# EAGLE design board (EAGLE 9.3.0)
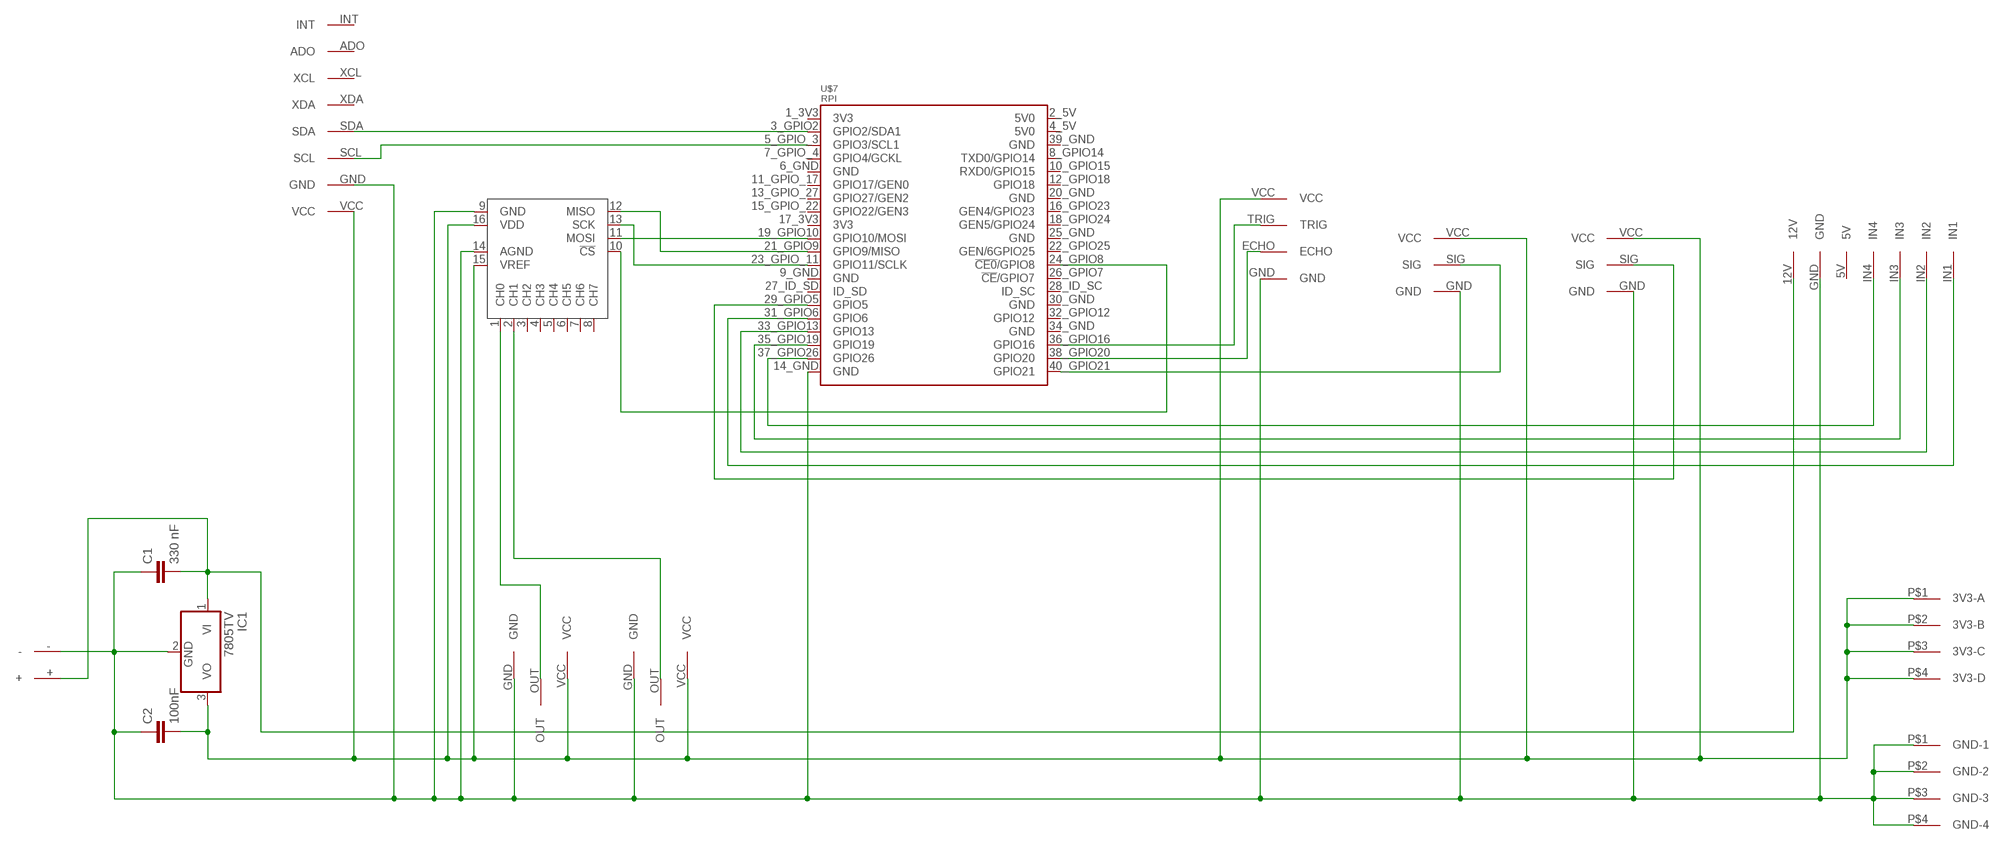
[diagram p0: schematic, sheet 1]

## Parts
C1  330 nF  C2.5/2  [C2.5-2]
C2  100nF  C2.5/2  [C2.5-2]
IC1  7805TV  [TO220V]
U$1  12V_SRC  [12V_SRC]
U$2  DC_REL  [DC_REL]
U$3  DC_REL  [DC_REL]
U$4  MCP3008P  [DIL16]
U$5  L298N-CONN  [L298N-CONN]
U$6  MPU6050  [MPU6050]
U$7  RPI  [RPI]
U$8  HC-SR04  [HC-SR04]
U$9  DISTANCE_SENSOR_ANALOG  [DISTANCE_SENSOR_ANALOG]
U$10  DISTANCE_SENSOR_ANALOG  [DISTANCE_SENSOR_ANALOG]
U$11  3V3-4  [3.3V-4]
U$12  GND-4  [GND-4]

## Nets
GND@3 [Power]: C1.1 C2.1 IC1.2(GND) U$1.- U$2.GND U$3.GND U$4.9(GND) U$4.14(AGND) U$5.GND U$6.GND U$7.14_GND(GND) U$8.GND U$9.GND U$10.GND U$12.P$1(GND-1) U$12.P$2(GND-2) U$12.P$3(GND-3) U$12.P$4(GND-4)
N$1: U$4.1(CH0) U$9.OUT
N$2: U$4.2(CH1) U$10.OUT
N$7 [Power]: C1.2 IC1.1(VI) U$1.+ U$5.12V
N$9: U$6.SDA U$7.3_GPIO2(GPIO2/SDA1)
N$11: U$6.SCL U$7.5_GPIO_3(GPIO3/SCL1)
N$14: U$5.IN4 U$7.37_GPIO26(GPIO26)
N$15: U$4.11(MOSI) U$7.19_GPIO10(GPIO10/MOSI)
N$16: U$4.12(MISO) U$7.21_GPIO9(GPIO9/MISO)
N$17: U$4.13(SCK) U$7.23_GPIO_11(GPIO11/SCLK)
N$18: U$4.10(!CS) U$7.24_GPIO8(!CE0!/GPIO8)
N$19: U$5.IN3 U$7.35_GPIO19(GPIO19)
N$21: U$5.IN2 U$7.33_GPIO13(GPIO13)
N$22: U$5.IN1 U$7.31_GPIO6(GPIO6)
N$23: U$3.SIG U$7.29_GPIO5(GPIO5)
N$24: U$2.SIG U$7.40_GPIO21(GPIO21)
N$25: U$7.38_GPIO20(GPIO20) U$8.ECHO
N$26: U$7.36_GPIO16(GPIO16) U$8.TRIG
N$31 [Power]: C2.2 IC1.3(VO) U$2.VCC U$3.VCC U$4.15(VREF) U$4.16(VDD) U$6.VCC U$8.VCC U$9.VCC U$10.VCC U$11.P$1(3V3-A) U$11.P$2(3V3-B) U$11.P$3(3V3-C) U$11.P$4(3V3-D)
Unconnected: U$4.3(CH2) U$4.4(CH3) U$4.5(CH4) U$4.6(CH5) U$4.7(CH6) U$4.8(CH7) U$5.5V U$6.ADO U$6.INT U$6.XCL U$6.XDA U$7.1_3V3(3V3) U$7.2_5V(5V0) U$7.4_5V(5V0) U$7.6_GND(GND) U$7.7_GPIO_4(GPIO4/GCKL) U$7.8_GPIO14(TXD0/GPIO14) U$7.9_GND(GND) U$7.10_GPIO15(RXD0/GPIO15) U$7.11_GPIO_17(GPIO17/GEN0) U$7.12_GPIO18(GPIO18) U$7.13_GPIO_27(GPIO27/GEN2) U$7.15_GPIO_22(GPIO22/GEN3) U$7.16_GPIO23(GEN4/GPIO23) U$7.17_3V3(3V3) U$7.18_GPIO24(GEN5/GPIO24) U$7.20_GND(GND) U$7.22_GPIO25(GEN/6GPIO25) U$7.25_GND(GND) U$7.26_GPIO7(!CE!/GPIO7) U$7.27_ID_SD(ID_SD) U$7.28_ID_SC(ID_SC) U$7.30_GND(GND) U$7.32_GPIO12(GPIO12) U$7.34_GND(GND) U$7.39_GND(GND)

## Library data of the parts
C1 C2 = capacitor-wima:C: CAPACITOR naming: grid - package width
IC1 = linear:78*: Positive VOLTAGE REGULATOR Source: http://cache.national.com/ds/LM/LM78L05.pdf http://www.fairchildsemi.com/ds/LM/LM7805.pdf
U$1 = home-mind:12V_SRC
U$2 U$3 = home-mind:DC_REL
U$4 = MCP3008:MCP3008
U$5 = home-mind:L298N-CONN
U$6 = home-mind:MPU6050
U$7 = home-mind:RPI
U$8 = home-mind:HC-SR04
U$9 U$10 = home-mind:DISTANCE_SENSOR_ANALOG
U$11 = home-mind:3V3-4
U$12 = home-mind:GND-4

## Net classes
0 default: width 0.3 mm, drill 0.3 mm, clearance 0.3 mm
1 Power: width 1.2 mm, drill 0.5 mm, clearance 0.5 mm

## Board
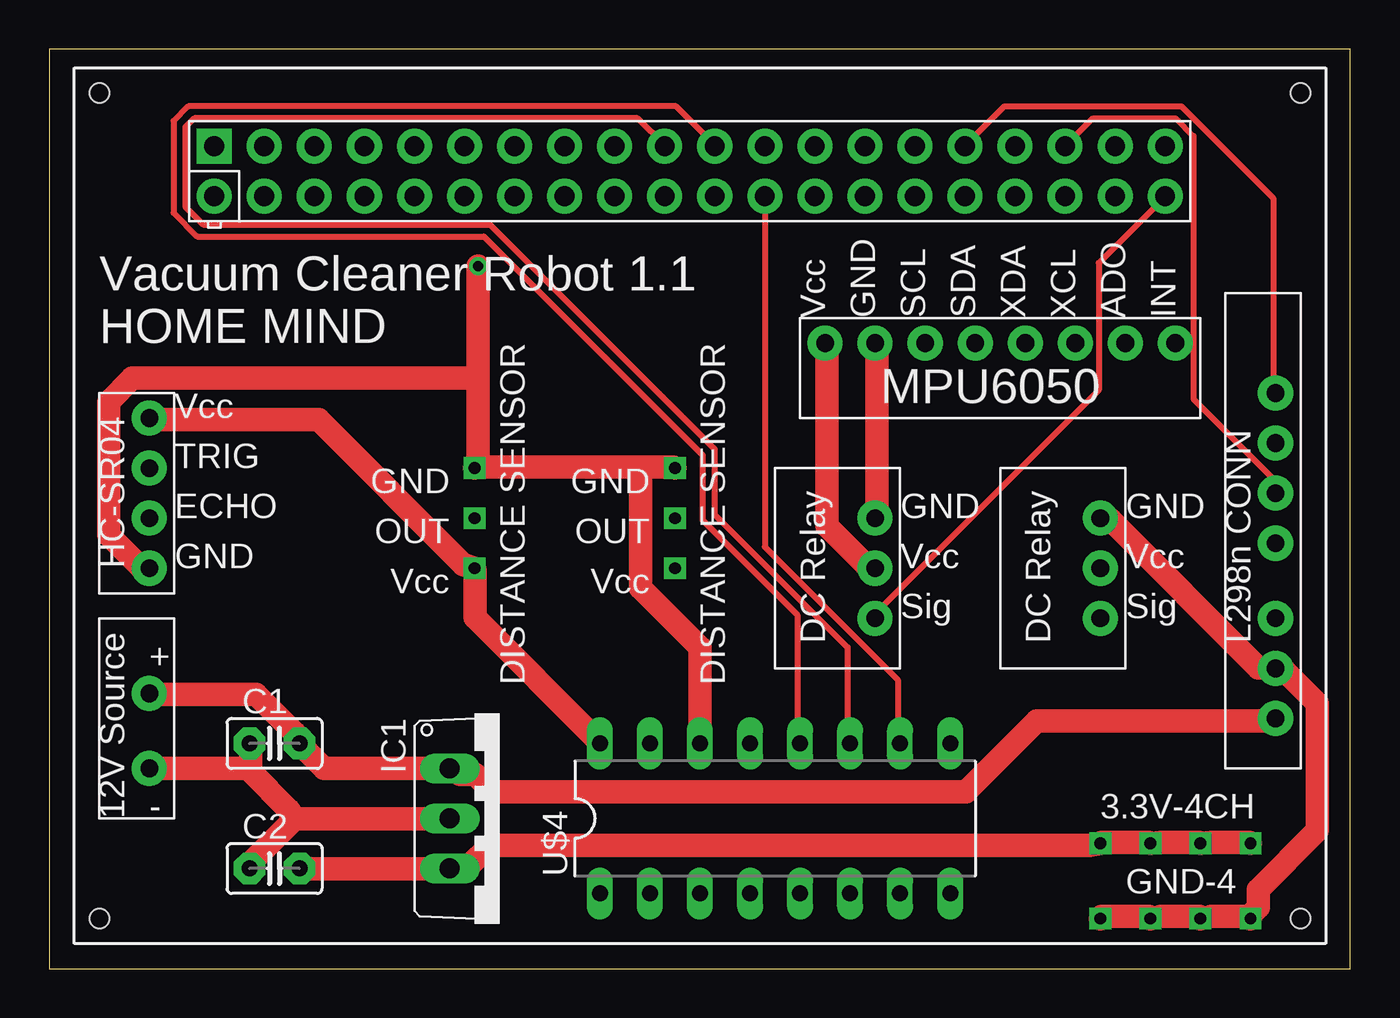
[diagram p1: board, top side]
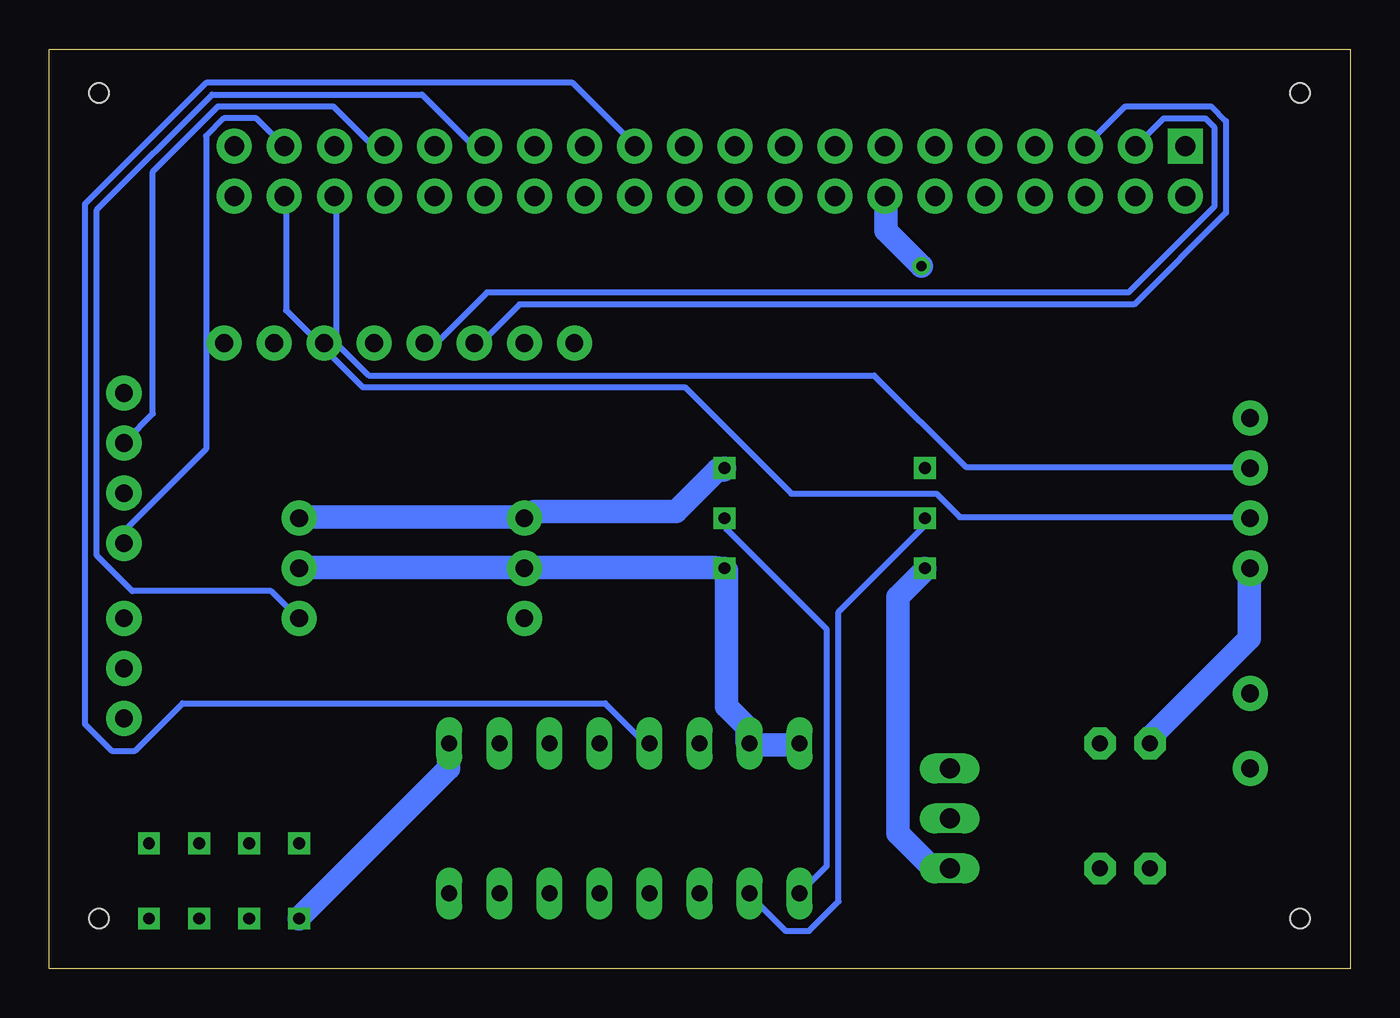
[diagram p2: board, bottom side, seen from below]

Size 66.02 x 46.66 mm. Coordinates in mm from the lower left corner, seen from the top.
Outline: 0,0 66.02,0 66.02,46.66 0,46.66 0,0
Copper layers (1*16): Top 0.035mm / dielectric 1.5mm / Bottom 0.035mm
Design rules "default": minimum track width 6mil, minimum drill 0.35mm, track to track 6mil, track to pad 6mil, pad to pad 6mil, via to via 6mil, smd to smd 6mil, copper to edge 40mil, drill to drill 6mil, minimum pad ring 10mil, minimum via ring 8mil, stop-mask expansion 4mil, vias tented up to drill 0mil, thermal gap 10mil
Holes 1 mm at 63.5,2.54 2.54,44.45 2.54,2.54 63.5,44.45

### Footprints (pad centres in the part's own frame; a part is rotated, then mirrored left to right if it is on the bottom)
C2.5-2 = drill 0.813 pad 1.6 octagon: 1 -1.27,0; 2 1.27,0
TO220V = drill 1.016 long: 1 -2.54,-2.54; 2 0,-2.54; 3 2.54,-2.54
12V_SRC = drill 0.9 pad 1.778: + 0,3.81; - 0,0
DC_REL = drill 0.9 pad 1.778: GND 0,5.08; SIG 0,0; VCC 0,2.54
DIL16 = drill 0.813 long: 1 -8.89,-3.81; 2 -6.35,-3.81; 3 -3.81,-3.81; 4 -1.27,-3.81; 5 1.27,-3.81; 6 3.81,-3.81; 7 6.35,-3.81; 8 8.89,-3.81; 9 8.89,3.81; 10 6.35,3.81; 11 3.81,3.81; 12 1.27,3.81; 13 -1.27,3.81; 14 -3.81,3.81; 15 -6.35,3.81; 16 -8.89,3.81
L298N-CONN = drill 0.9 pad 1.778: 5V 0,-11.43; 12V 0,-16.51; GND 0,-13.97; IN1 0,0; IN2 0,-2.54; IN3 0,-5.08; IN4 0,-7.62
MPU6050 = drill 0.9 pad 1.778: ADO 0,-5.08; GND 0,7.62; INT 0,-7.62; SCL 0,5.08; SDA 0,2.54; VCC 0,10.16; XCL 0,-2.54; XDA 0,0
RPI = drill 1 pad 1.778 square: 1_3V3 -24.65,1.1 | drill 1 pad 1.778: 2_5V -24.65,-1.44; 3_GPIO2 -22.11,1.1; 4_5V -22.11,-1.44; 5_GPIO_3 -19.57,1.1; 6_GND -19.57,-1.44; 7_GPIO_4 -17.03,1.1; 8_GPIO14 -17.03,-1.44; 9_GND -14.49,1.1; 10_GPIO15 -14.49,-1.44; 11_GPIO_17 -11.95,1.1; 12_GPIO18 -11.95,-1.44; 13_GPIO_27 -9.41,1.1; 14_GND -9.41,-1.44; 15_GPIO_22 -6.87,1.1; 16_GPIO23 -6.87,-1.44; 17_3V3 -4.33,1.1; 18_GPIO24 -4.33,-1.44; 19_GPIO10 -1.79,1.1; 20_GND -1.79,-1.44; 21_GPIO9 0.75,1.1; 22_GPIO25 0.75,-1.44; 23_GPIO_11 3.29,1.1; 24_GPIO8 3.29,-1.44; 25_GND 5.83,1.1; 26_GPIO7 5.83,-1.44; 27_ID_SD 8.37,1.1; 28_ID_SC 8.37,-1.44; 29_GPIO5 10.91,1.1; 30_GND 10.91,-1.44; 31_GPIO6 13.45,1.1; 32_GPIO12 13.45,-1.44; 33_GPIO13 15.99,1.1; 34_GND 15.99,-1.44; 35_GPIO19 18.53,1.1; 36_GPIO16 18.53,-1.44; 37_GPIO26 21.07,1.1; 38_GPIO20 21.07,-1.44; 39_GND 23.61,1.1; 40_GPIO21 23.61,-1.44
HC-SR04 = drill 0.9 pad 1.778: ECHO 0,0; GND 0,-2.54; TRIG 0,2.54; VCC 0,5.08
DISTANCE_SENSOR_ANALOG = drill 0.6 square: GND 0,-2.54; OUT 0,0; VCC 0,2.54
3.3V-4 = drill 0.6 square: P$1 0,0; P$2 2.54,0; P$3 5.08,0; P$4 7.62,0
GND-4 = drill 0.6 square: P$1 0,0; P$2 2.54,0; P$3 5.08,0; P$4 7.62,0

### Placement (x,y rotation side)
C1  11.43,11.43 0 top
C2  11.43,5.08 0 top
IC1  22.86,7.62 270 top
U$1  5.08,10.16 0 top
U$2  41.91,17.78 0 top
U$3  53.34,17.78 0 top
U$4  36.83,7.62 0 top
U$5  62.23,29.21 0 top
U$6  49.53,31.75 90 top
U$7  33.02,40.64 0 top
U$8  5.08,22.86 0 top
U$9  31.75,22.86 180 top
U$10  21.59,22.86 180 top
U$11  53.34,6.35 0 top
U$12  53.34,2.54 0 top

### Tracks (layer width: path | path; a pad name or v marks a point on that pad's centre or on a via)
GND@3  (via drill 0.5)
  Top 1.2: U$12.P$1 53.41,2.66 55.81,2.66 U$12.P$2 56.41,2.66 58.36,2.66 U$12.P$3 58.96,2.66 60.91,2.66 | 60.91,2.66 U$12.P$4 | U$2.GND 42.01,22.91 42.01,31.61 U$6.GND | U$3.GND 53.41,22.76 53.86,22.76 61.36,15.26 62.11,15.26 U$5.GND 62.71,15.11 64.36,13.46 64.36,7.01 61.36,4.01 61.36,3.11 60.91,2.66 | 12.46,7.61 20.26,7.61 IC1.2 | 12.46,7.61 10.06,5.21 C2.1 | 10.21,10.16 10.21,10.01 12.16,8.06 12.46,7.61 | 10.21,10.16 10.21,11.36 C1.1 | 10.21,10.16 U$1.- | 30.01,25.46 31.66,25.46 U$9.GND | 30.01,25.46 21.61,25.46 U$10.GND 21.76,25.91 21.76,29.96 | 30.01,25.46 30.01,19.31 33.01,16.31 33.01,11.51 U$4.14 | 21.76,29.96 v21.76,35.66 | 21.76,29.96 4.21,29.96 3.01,28.76 3.01,22.01 4.66,20.36 4.96,20.36 U$8.GND
  Bottom 1.2: U$4.9 45.76,11.36 45.76,10.16 53.26,2.66 U$12.P$1 | U$3.GND 53.26,22.91 42.01,22.91 U$2.GND 41.41,23.21 34.21,23.21 32.11,25.31 31.81,25.31 U$9.GND | U$8.GND 5.11,20.21 5.11,16.76 10.06,11.81 10.06,11.51 C1.1 | v21.76,35.66 23.56,37.46 23.56,39.11 U$7.14_GND
N$1
  Bottom 0.3: U$9.OUT 31.66,22.76 31.66,22.31 26.56,17.21 26.56,5.21 27.91,3.86 U$4.1
N$2
  Bottom 0.3: U$10.OUT 21.61,22.76 21.61,22.46 25.96,18.11 25.96,3.41 27.46,1.91 28.66,1.91 30.46,3.71 U$4.2
N$7
  Top 1.2: U$1.+ 5.11,13.91 10.51,13.91 12.46,11.96 C1.2 12.76,11.36 13.96,10.16 IC1.1 20.86,9.86 21.61,9.86 22.51,8.96 46.51,8.96 50.11,12.56 62.11,12.56 U$5.12V
N$9
  Bottom 0.3: U$6.SDA 46.96,31.76 46.36,31.76 43.81,34.31 11.26,34.31 6.91,38.66 6.91,42.71 7.36,43.16 9.46,43.16 10.81,41.81 U$7.3_GPIO2
N$11
  Bottom 0.3: U$6.SCL 44.41,31.76 44.11,31.76 42.16,33.71 10.96,33.71 6.31,38.36 6.31,43.01 7.06,43.76 11.41,43.76 13.36,41.81 U$7.5_GPIO_3
N$14
  Bottom 0.3: U$7.37_GPIO26 55.51,43.16 57.16,43.16 58.06,42.26 58.06,26.36 62.11,22.31 62.11,21.71 U$5.IN4
N$15
  Top 0.3: U$4.11 40.51,11.51 40.51,16.31 33.76,23.06 33.76,26.36 22.36,37.76 7.81,37.76 6.91,38.66 6.91,42.71 7.36,43.16 29.86,43.16 31.21,41.81 U$7.19_GPIO10
N$16
  Top 0.3: U$4.12 37.96,11.51 37.96,17.96 33.16,22.76 33.16,26.06 22.06,37.16 7.51,37.16 6.31,38.36 6.31,43.01 7.06,43.76 31.81,43.76 33.76,41.81 U$7.21_GPIO9
N$17
  Bottom 0.3: U$4.13 35.56,11.51 35.86,11.51 37.81,13.46 59.26,13.46 61.66,11.06 62.86,11.06 64.21,12.41 64.21,38.81 58.06,44.96 39.46,44.96 36.31,41.81 U$7.23_GPIO_11
N$18
  Top 0.3: U$7.24_GPIO8 36.31,21.41 43.06,14.66 43.06,11.51 U$4.10
N$19
  Top 0.3: U$5.IN3 62.11,24.26 62.11,24.86 58.06,28.91 58.06,42.26 57.16,43.16 52.96,43.16 51.61,41.81 U$7.35_GPIO19
N$21
  Bottom 0.3: U$7.33_GPIO13 49.06,41.81 49.66,41.81 51.61,43.76 57.46,43.76 60.76,40.46 60.76,28.16 62.11,26.81 U$5.IN2
N$22
  Top 0.3: U$5.IN1 62.11,29.21 62.11,39.11 57.46,43.76 48.46,43.76 46.51,41.81 U$7.31_GPIO6
N$23
  Bottom 0.3: U$7.29_GPIO5 43.96,41.81 44.56,41.81 47.11,44.36 57.76,44.36 63.61,38.51 63.61,20.96 61.81,19.16 54.76,19.16 53.41,17.81 U$3.SIG
N$24
  Top 0.3: U$2.SIG 42.01,17.81 42.01,18.11 53.26,29.36 53.26,35.81 56.56,39.11 U$7.40_GPIO21
N$25
  Bottom 0.3: U$8.ECHO 5.11,22.91 19.81,22.91 21.01,24.11 28.36,24.11 33.76,29.51 50.11,29.51 54.01,33.41 54.01,39.11 U$7.38_GPIO20
N$26
  Bottom 0.3: U$8.TRIG 5.11,25.46 19.51,25.46 24.16,30.11 49.81,30.11 51.46,31.76 51.46,39.11 U$7.36_GPIO16
N$31
  Top 1.2: U$11.P$4 60.91,6.41 58.96,6.41 U$11.P$3 58.36,6.41 56.41,6.41 U$11.P$2 55.81,6.41 53.41,6.41 U$11.P$1 52.81,6.26 22.36,6.26 21.31,5.21 20.86,5.21 IC1.3 20.26,5.06 12.76,5.06 C2.2 | U$4.16 27.91,11.51 21.61,17.81 21.61,20.21 U$10.VCC 21.01,20.51 13.66,27.86 5.11,27.86 U$8.VCC | U$6.VCC 39.46,31.61 39.46,22.46 41.56,20.36 41.86,20.36 U$2.VCC
  Bottom 1.2: U$3.VCC 53.26,20.36 42.46,20.36 U$2.VCC 41.86,20.36 32.26,20.36 U$9.VCC 31.66,20.21 31.66,13.31 30.61,12.26 30.61,11.51 U$4.15 29.86,11.36 28.06,11.36 U$4.16 | IC1.3 20.41,5.21 21.31,5.21 22.96,6.86 22.96,18.86 21.61,20.21 U$10.VCC

### Text on the board
tNames: Vacuum Cleaner Robot 1.1 / HOME MIND